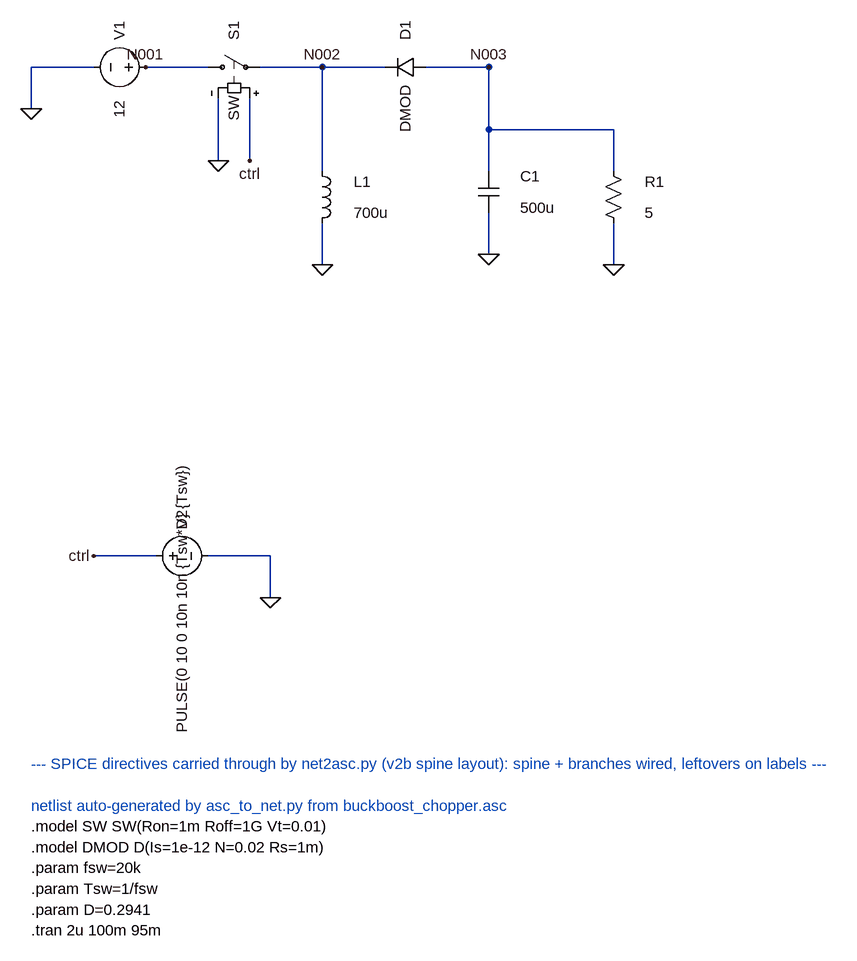
[diagram p0: schematic buckboost_chopper.asc]
buckboost_chopper.asc, the LTspice schematic file:
Version 4
SHEET 1 2080 1664
WIRE 64 144 64 208
WIRE 64 144 160 144
WIRE 240 144 336 144
WIRE 400 192 400 288
WIRE 352 192 352 288
WIRE 416 144 512 144
WIRE 512 144 608 144
WIRE 672 144 768 144
WIRE 512 144 512 240
WIRE 512 240 512 304
WIRE 512 384 512 448
WIRE 768 144 768 240
WIRE 768 240 768 304
WIRE 768 368 768 432
WIRE 768 144 768 240
WIRE 768 240 960 240
WIRE 960 240 960 304
WIRE 960 384 960 448
WIRE 160 896 256 896
WIRE 336 896 432 896
WIRE 432 896 432 960
FLAG 64 208 0
FLAG 400 288 ctrl
FLAG 352 288 0
FLAG 512 144 N002
FLAG 768 144 N003
FLAG 512 448 0
FLAG 768 432 0
FLAG 960 448 0
FLAG 160 896 ctrl
FLAG 432 960 0
FLAG 240 144 N001
SYMBOL voltage 256 144 R90
WINDOW 0 -56 56 Center 2
WINDOW 3 64 56 Center 2
SYMATTR InstName V1
SYMATTR Value 12
SYMBOL sw 320 144 R270
WINDOW 0 56 56 Center 2
WINDOW 3 -64 56 Center 2
SYMATTR InstName S1
SYMATTR Value SW
SYMBOL diode 672 128 R90
WINDOW 0 -40 32 Center 2
WINDOW 3 80 32 Center 2
SYMATTR InstName D1
SYMATTR Value DMOD
SYMBOL ind 496 288 R0
WINDOW 0 64 32 Left 2
WINDOW 3 64 80 Left 2
SYMATTR InstName L1
SYMATTR Value 700u
SYMBOL cap 752 304 R0
WINDOW 0 64 8 Left 2
WINDOW 3 64 56 Left 2
SYMATTR InstName C1
SYMATTR Value 500u
SYMBOL res 944 288 R0
WINDOW 0 64 32 Left 2
WINDOW 3 64 80 Left 2
SYMATTR InstName R1
SYMATTR Value 5
SYMBOL voltage 240 896 R270
WINDOW 0 56 56 Center 2
WINDOW 3 -64 56 Center 2
SYMATTR InstName V2
SYMATTR Value PULSE(0 10 0 10n 10n {Tsw*D} {Tsw})
TEXT 64 1216 Left 2 ;--- SPICE directives carried through by net2asc.py (v2b spine layout): spine + branches wired, leftovers on labels ---
TEXT 64 1280 Left 2 ;netlist auto-generated by asc_to_net.py from buckboost_chopper.asc
TEXT 64 1312 Left 2 !.model SW SW(Ron=1m Roff=1G Vt=0.01)
TEXT 64 1344 Left 2 !.model DMOD D(Is=1e-12 N=0.02 Rs=1m)
TEXT 64 1376 Left 2 !.param fsw=20k
TEXT 64 1408 Left 2 !.param Tsw=1/fsw
TEXT 64 1440 Left 2 !.param D=0.2941
TEXT 64 1472 Left 2 !.tran 2u 100m 95m

The netlist it stands for:
* buckboost_chopper.asc
V1 N001 0 12
S1 N001 N002 ctrl 0 SW
D1 N003 N002 DMOD
L1 N002 0 700u
C1 N003 0 500u
R1 N003 0 5
V2 ctrl 0 PULSE(0 10 0 10n 10n {Tsw*D} {Tsw})
.model D D
.lib standard.dio
* --- SPICE directives carried through by net2asc.py (v2b spine layout): spine + branches wired, leftovers on labels ---
* netlist auto-generated by asc_to_net.py from buckboost_chopper.asc
.model SW SW(Ron=1m Roff=1G Vt=0.01)
.model DMOD D(Is=1e-12 N=0.02 Rs=1m)
.param fsw=20k
.param Tsw=1/fsw
.param D=0.2941
.tran 2u 100m 95m
.backanno
.end